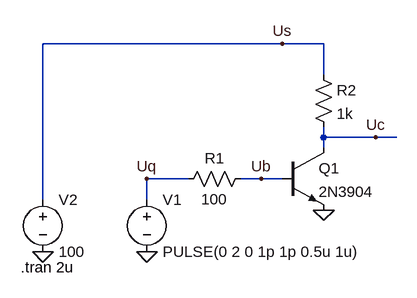
[diagram p0: schematic sim01.asc]
sim01.asc, the LTspice schematic file:
Version 4
SHEET 1 880 680
WIRE 128 16 -240 16
WIRE 192 16 128 16
WIRE 192 64 192 16
WIRE 192 160 192 144
WIRE 272 160 192 160
WIRE 304 160 272 160
WIRE 192 176 192 160
WIRE -16 224 -80 224
WIRE 96 224 64 224
WIRE 128 224 96 224
WIRE -240 256 -240 16
WIRE -80 256 -80 224
FLAG -80 336 0
FLAG 192 272 0
FLAG -240 336 0
FLAG -80 224 Uq
FLAG 96 224 Ub
FLAG 128 16 Us
FLAG 272 160 Uc
SYMBOL npn 128 176 R0
SYMATTR InstName Q1
SYMATTR Value 2N3904
SYMBOL res -32 240 R270
WINDOW 0 32 56 VTop 2
WINDOW 3 0 56 VBottom 2
SYMATTR InstName R1
SYMATTR Value 100
SYMBOL res 176 48 R0
SYMATTR InstName R2
SYMATTR Value 1k
SYMBOL voltage -80 240 R0
WINDOW 123 0 0 Left 2
WINDOW 39 0 0 Left 2
SYMATTR InstName V1
SYMATTR Value PULSE(0 2 0 1p 1p 0.5u 1u)
SYMBOL voltage -240 240 R0
WINDOW 123 0 0 Left 2
WINDOW 39 0 0 Left 2
SYMATTR InstName V2
SYMATTR Value 100
TEXT -274 360 Left 2 !.tran 2u

The netlist it stands for:
* sim01.asc
Q1 Uc Ub 0 0 2N3904
R1 Uq Ub 100
R2 Us Uc 1k
V1 Uq 0 PULSE(0 2 0 1p 1p 0.5u 1u)
V2 Us 0 100
.model NPN NPN
.model PNP PNP
.lib standard.bjt
.tran 2u
.backanno
.end